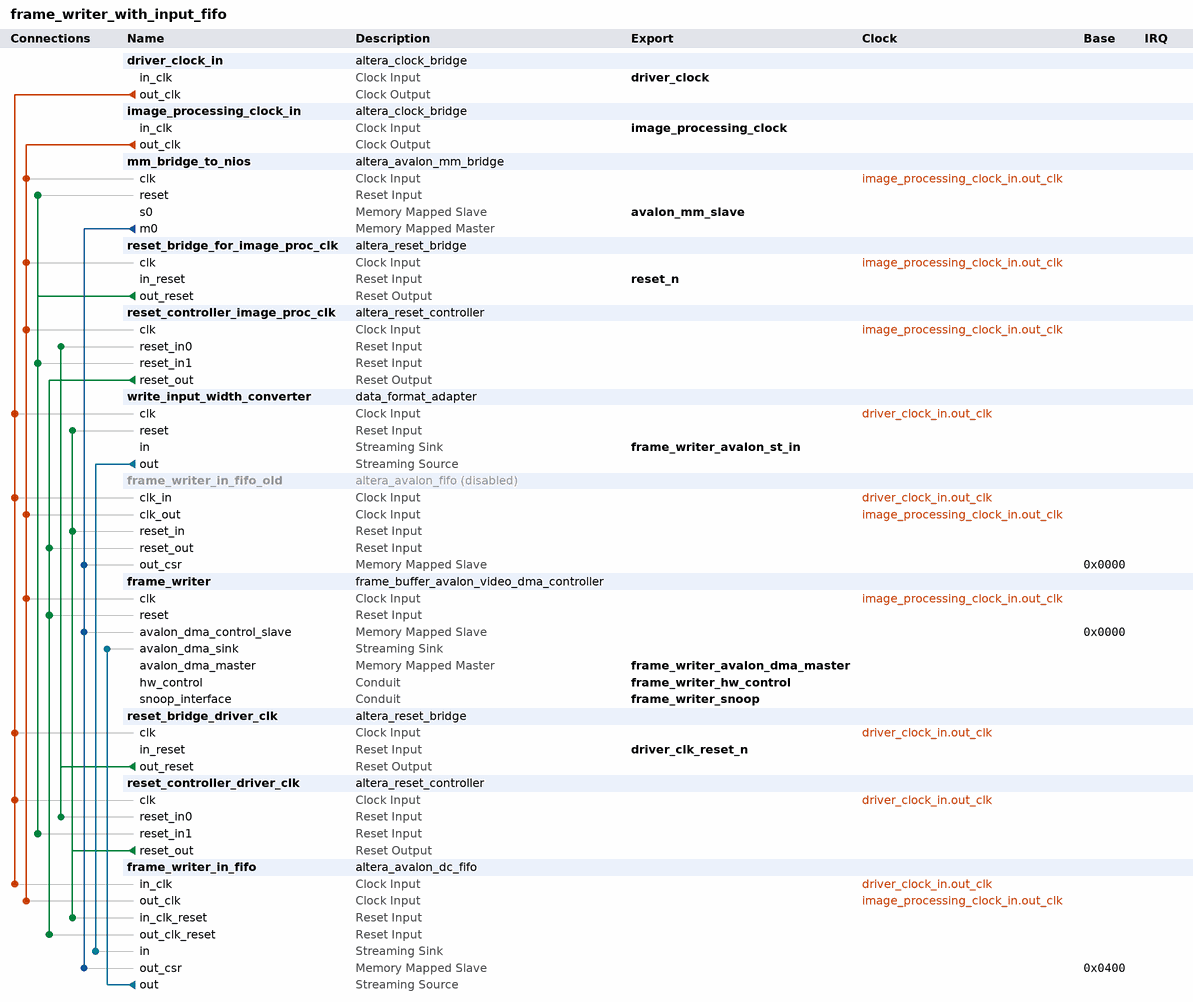
[diagram p0: system contents]
# Platform Designer (Qsys) system frame_writer_with_input_fifo, Cyclone V 5CGXFC9E6F31C7
# Parameters at their usual value, and those the tool derives, are not listed.
package require -exact qsys 18.1
create_system frame_writer_with_input_fifo
set_project_property DEVICE_FAMILY {Cyclone V}
set_project_property DEVICE 5CGXFC9E6F31C7

add_instance driver_clock_in altera_clock_bridge 18.1
set_instance_parameter_value driver_clock_in DERIVED_CLOCK_RATE 0
set_instance_parameter_value driver_clock_in EXPLICIT_CLOCK_RATE 0

add_instance image_processing_clock_in altera_clock_bridge 18.1
set_instance_parameter_value image_processing_clock_in DERIVED_CLOCK_RATE 0
set_instance_parameter_value image_processing_clock_in EXPLICIT_CLOCK_RATE 0

add_instance mm_bridge_to_nios altera_avalon_mm_bridge 18.1
set_instance_parameter_value mm_bridge_to_nios ADDRESS_UNITS SYMBOLS
set_instance_parameter_value mm_bridge_to_nios ADDRESS_WIDTH 8
set_instance_parameter_value mm_bridge_to_nios DATA_WIDTH 32
set_instance_parameter_value mm_bridge_to_nios MAX_PENDING_RESPONSES 4
set_instance_parameter_value mm_bridge_to_nios USE_AUTO_ADDRESS_WIDTH 1

add_instance reset_bridge_for_image_proc_clk altera_reset_bridge 18.1
set_instance_parameter_value reset_bridge_for_image_proc_clk ACTIVE_LOW_RESET 1
set_instance_parameter_value reset_bridge_for_image_proc_clk SYNCHRONOUS_EDGES both

add_instance reset_controller_image_proc_clk altera_reset_controller 18.1
set_instance_parameter_value reset_controller_image_proc_clk NUM_RESET_INPUTS 2
set_instance_parameter_value reset_controller_image_proc_clk OUTPUT_RESET_SYNC_EDGES both
set_instance_parameter_value reset_controller_image_proc_clk SYNC_DEPTH 3

add_instance write_input_width_converter data_format_adapter 18.1
set_instance_parameter_value write_input_width_converter inBitsPerSymbol 16
set_instance_parameter_value write_input_width_converter inChannelWidth 0
set_instance_parameter_value write_input_width_converter inErrorWidth 0
set_instance_parameter_value write_input_width_converter inMaxChannel 0
set_instance_parameter_value write_input_width_converter inReadyLatency 0
set_instance_parameter_value write_input_width_converter inSymbolsPerBeat 1
set_instance_parameter_value write_input_width_converter inUseEmpty false
set_instance_parameter_value write_input_width_converter inUseEmptyPort NO
set_instance_parameter_value write_input_width_converter inUsePackets true
set_instance_parameter_value write_input_width_converter outSymbolsPerBeat 4
set_instance_parameter_value write_input_width_converter outUseEmpty false
set_instance_parameter_value write_input_width_converter outUseEmptyPort YES

add_instance frame_writer_in_fifo_old altera_avalon_fifo 18.1
set_instance_property frame_writer_in_fifo_old ENABLED false
set_instance_parameter_value frame_writer_in_fifo_old bitsPerSymbol 64
set_instance_parameter_value frame_writer_in_fifo_old channelWidth 0
set_instance_parameter_value frame_writer_in_fifo_old errorWidth 0
set_instance_parameter_value frame_writer_in_fifo_old fifoDepth 1024
set_instance_parameter_value frame_writer_in_fifo_old fifoInputInterfaceOptions AVALONST_SINK
set_instance_parameter_value frame_writer_in_fifo_old fifoOutputInterfaceOptions AVALONST_SOURCE
set_instance_parameter_value frame_writer_in_fifo_old singleClockMode false
set_instance_parameter_value frame_writer_in_fifo_old symbolsPerBeat 4
set_instance_parameter_value frame_writer_in_fifo_old useIRQ true
set_instance_parameter_value frame_writer_in_fifo_old usePacket true
set_instance_parameter_value frame_writer_in_fifo_old useReadControl true
set_instance_parameter_value frame_writer_in_fifo_old useWriteControl false

add_instance frame_writer frame_buffer_avalon_video_dma_controller 14.1
set_instance_parameter_value frame_writer always_do_buffer_swap true
set_instance_parameter_value frame_writer bits_per_pixel 16
set_instance_parameter_value frame_writer dma_enabled true
set_instance_parameter_value frame_writer mode {From Stream to Memory}
set_instance_parameter_value frame_writer num_pixels_in_frame 1048576
set_instance_parameter_value frame_writer num_watchdog_bits 64
set_instance_parameter_value frame_writer override_external_swap_buffers_now false
set_instance_parameter_value frame_writer override_val_for_external_swap_buffers_now false
set_instance_parameter_value frame_writer parallelization_ratio 4
set_instance_parameter_value frame_writer swap_symbols_for_ddr_write true
set_instance_parameter_value frame_writer use_external_backbuffer true
set_instance_parameter_value frame_writer watchdog_count 2000000000
set_instance_parameter_value frame_writer watchdog_enabled true

add_instance reset_bridge_driver_clk altera_reset_bridge 18.1
set_instance_parameter_value reset_bridge_driver_clk ACTIVE_LOW_RESET 1
set_instance_parameter_value reset_bridge_driver_clk SYNCHRONOUS_EDGES both

add_instance reset_controller_driver_clk altera_reset_controller 18.1
set_instance_parameter_value reset_controller_driver_clk NUM_RESET_INPUTS 2
set_instance_parameter_value reset_controller_driver_clk OUTPUT_RESET_SYNC_EDGES both
set_instance_parameter_value reset_controller_driver_clk SYNC_DEPTH 3

add_instance frame_writer_in_fifo altera_avalon_dc_fifo 18.1
set_instance_parameter_value frame_writer_in_fifo BITS_PER_SYMBOL 16
set_instance_parameter_value frame_writer_in_fifo FIFO_DEPTH 1024
set_instance_parameter_value frame_writer_in_fifo SYMBOLS_PER_BEAT 4
set_instance_parameter_value frame_writer_in_fifo USE_OUT_FILL_LEVEL 1
set_instance_parameter_value frame_writer_in_fifo USE_PACKETS 1

# connections
add_connection driver_clock_in.out_clk frame_writer_in_fifo.in_clk clock
add_connection driver_clock_in.out_clk frame_writer_in_fifo_old.clk_in clock
add_connection driver_clock_in.out_clk reset_bridge_driver_clk.clk clock
add_connection driver_clock_in.out_clk reset_controller_driver_clk.clk clock
add_connection driver_clock_in.out_clk write_input_width_converter.clk clock
add_connection image_processing_clock_in.out_clk frame_writer.clk clock
add_connection image_processing_clock_in.out_clk frame_writer_in_fifo.out_clk clock
add_connection image_processing_clock_in.out_clk frame_writer_in_fifo_old.clk_out clock
add_connection image_processing_clock_in.out_clk mm_bridge_to_nios.clk clock
add_connection image_processing_clock_in.out_clk reset_bridge_for_image_proc_clk.clk clock
add_connection image_processing_clock_in.out_clk reset_controller_image_proc_clk.clk clock
add_connection reset_bridge_driver_clk.out_reset reset_controller_driver_clk.reset_in0 reset
add_connection reset_bridge_driver_clk.out_reset reset_controller_image_proc_clk.reset_in0 reset
add_connection reset_bridge_for_image_proc_clk.out_reset mm_bridge_to_nios.reset reset
add_connection reset_bridge_for_image_proc_clk.out_reset reset_controller_driver_clk.reset_in1 reset
add_connection reset_bridge_for_image_proc_clk.out_reset reset_controller_image_proc_clk.reset_in1 reset
add_connection reset_controller_driver_clk.reset_out frame_writer_in_fifo.in_clk_reset reset
add_connection reset_controller_driver_clk.reset_out frame_writer_in_fifo_old.reset_in reset
add_connection reset_controller_driver_clk.reset_out write_input_width_converter.reset reset
add_connection reset_controller_image_proc_clk.reset_out frame_writer.reset reset
add_connection reset_controller_image_proc_clk.reset_out frame_writer_in_fifo.out_clk_reset reset
add_connection reset_controller_image_proc_clk.reset_out frame_writer_in_fifo_old.reset_out reset
add_connection mm_bridge_to_nios.m0 frame_writer.avalon_dma_control_slave avalon
set_connection_parameter_value mm_bridge_to_nios.m0/frame_writer.avalon_dma_control_slave baseAddress 0x0000
add_connection mm_bridge_to_nios.m0 frame_writer_in_fifo.out_csr avalon
set_connection_parameter_value mm_bridge_to_nios.m0/frame_writer_in_fifo.out_csr baseAddress 0x0400
add_connection mm_bridge_to_nios.m0 frame_writer_in_fifo_old.out_csr avalon
set_connection_parameter_value mm_bridge_to_nios.m0/frame_writer_in_fifo_old.out_csr baseAddress 0x0000
add_connection frame_writer_in_fifo.out frame_writer.avalon_dma_sink avalon_streaming
add_connection write_input_width_converter.out frame_writer_in_fifo.in avalon_streaming

# exported interfaces
add_interface avalon_mm_slave avalon slave
set_interface_property avalon_mm_slave EXPORT_OF mm_bridge_to_nios.s0
add_interface driver_clk_reset_n reset sink
set_interface_property driver_clk_reset_n EXPORT_OF reset_bridge_driver_clk.in_reset
add_interface driver_clock clock sink
set_interface_property driver_clock EXPORT_OF driver_clock_in.in_clk
add_interface frame_writer_avalon_dma_master avalon master
set_interface_property frame_writer_avalon_dma_master EXPORT_OF frame_writer.avalon_dma_master
add_interface frame_writer_avalon_st_in avalon_streaming sink
set_interface_property frame_writer_avalon_st_in EXPORT_OF write_input_width_converter.in
add_interface frame_writer_hw_control conduit end
set_interface_property frame_writer_hw_control EXPORT_OF frame_writer.hw_control
add_interface frame_writer_snoop conduit end
set_interface_property frame_writer_snoop EXPORT_OF frame_writer.snoop_interface
add_interface image_processing_clock clock sink
set_interface_property image_processing_clock EXPORT_OF image_processing_clock_in.in_clk
add_interface reset_n reset sink
set_interface_property reset_n EXPORT_OF reset_bridge_for_image_proc_clk.in_reset

set_interconnect_requirement {$system} qsys_mm.clockCrossingAdapter AUTO
set_interconnect_requirement {$system} qsys_mm.maxAdditionalLatency 3

save_system frame_writer_with_input_fifo.qsys
